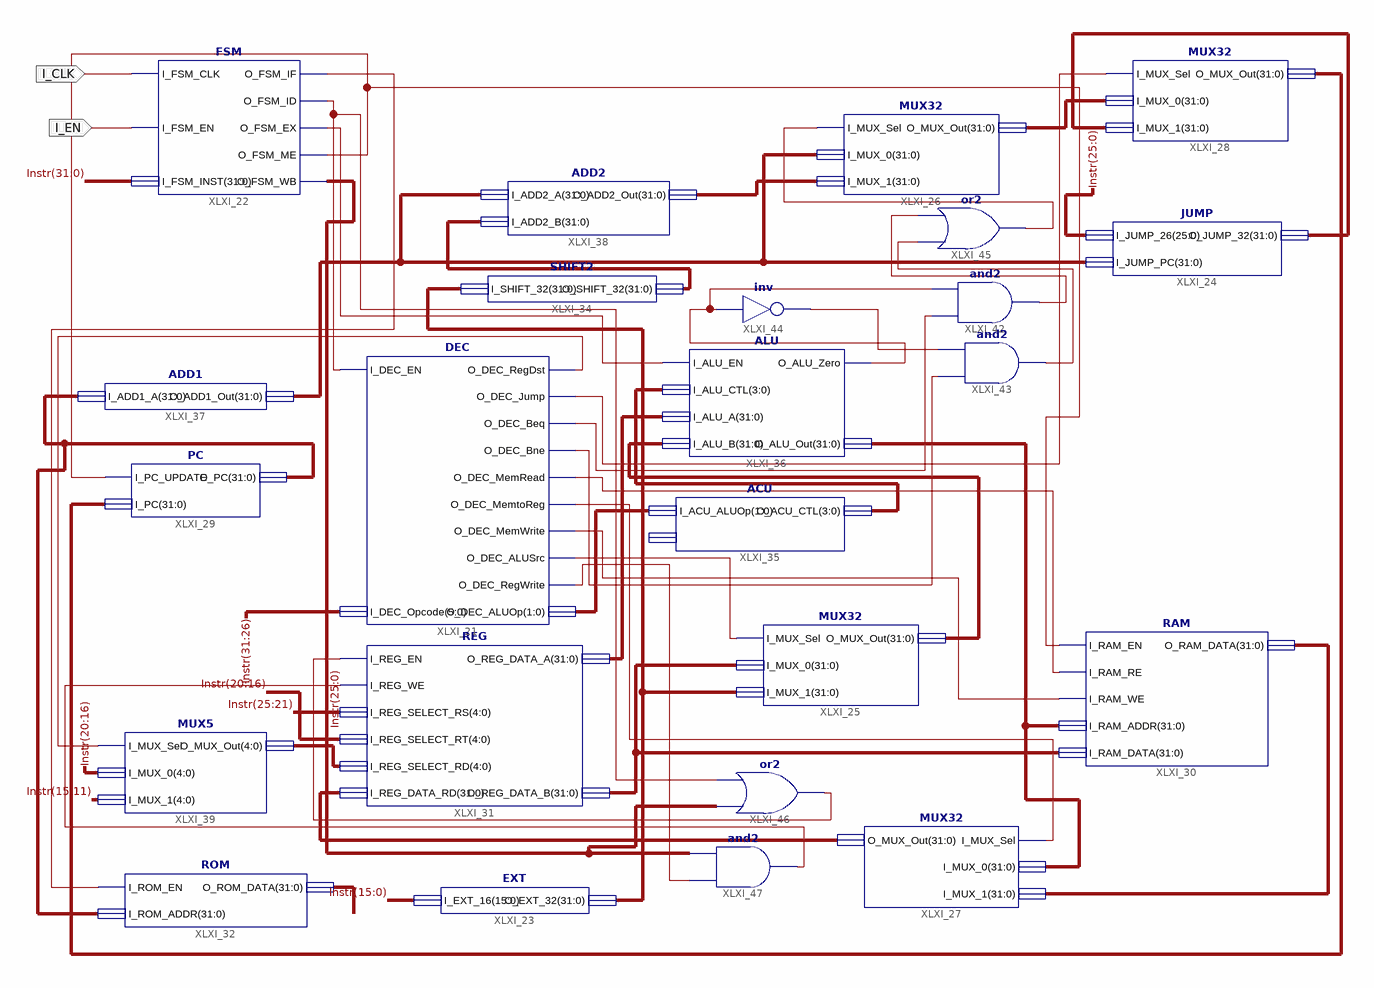
[diagram p0: schematic sheet 1]
// Xilinx ISE schematic CCSiMP32.sch (artix7) as structural Verilog: 24 symbols, 2 ports
module CCSiMP32 (
  input  I_CLK,
  input  I_EN
);

  wire XLXN_36, XLXN_37, XLXN_40, XLXN_41, XLXN_42, XLXN_43, XLXN_44, XLXN_45, XLXN_46, XLXN_47, XLXN_48,
       XLXN_49, XLXN_63, XLXN_67, XLXN_75, XLXN_77, XLXN_83, XLXN_84, XLXN_85, XLXN_87;
  wire [1:0] XLXN_65;
  wire [3:0] XLXN_28;
  wire [4:0] XLXN_12;
  wire [31:0] Instr, XLXN_13, XLXN_18, XLXN_21, XLXN_22, XLXN_24, XLXN_27, XLXN_29, XLXN_31, XLXN_32,
       XLXN_33, XLXN_34, XLXN_38, XLXN_39;

  DEC XLXI_21 (
    .I_DEC_EN(XLXN_67), .I_DEC_Opcode(Instr[31:26]), .O_DEC_RegDst(XLXN_36), .O_DEC_Jump(XLXN_37),
    .O_DEC_Beq(XLXN_40), .O_DEC_Bne(XLXN_41), .O_DEC_MemRead(XLXN_46), .O_DEC_MemtoReg(XLXN_47),
    .O_DEC_MemWrite(XLXN_48), .O_DEC_ALUSrc(XLXN_49), .O_DEC_RegWrite(XLXN_63), .O_DEC_ALUOp(XLXN_65));
  FSM XLXI_22 (
    .I_FSM_CLK(I_CLK), .I_FSM_EN(I_EN), .I_FSM_INST(Instr), .O_FSM_IF(XLXN_84), .O_FSM_ID(XLXN_67),
    .O_FSM_EX(XLXN_75), .O_FSM_ME(XLXN_85), .O_FSM_WB(Instr[25:0]));
  EXT XLXI_23 (.I_EXT_16(Instr[15:0]), .O_EXT_32(XLXN_21));
  JUMP XLXI_24 (.I_JUMP_26(Instr[25:0]), .I_JUMP_PC(XLXN_18), .O_JUMP_32(XLXN_38));
  MUX32 XLXI_26 (.I_MUX_Sel(XLXN_45), .I_MUX_0(XLXN_18), .I_MUX_1(XLXN_24), .O_MUX_Out(XLXN_39));
  MUX32 XLXI_27 (.I_MUX_Sel(XLXN_47), .I_MUX_0(XLXN_34), .I_MUX_1(XLXN_33), .O_MUX_Out(XLXN_32));
  MUX32 XLXI_28 (.I_MUX_Sel(XLXN_37), .I_MUX_0(XLXN_39), .I_MUX_1(XLXN_38), .O_MUX_Out(Instr[25:0]));
  PC XLXI_29 (.I_PC_UPDATE(XLXN_85), .I_PC(Instr[25:0]), .O_PC(XLXN_13));
  RAM XLXI_30 (
    .I_RAM_EN(XLXN_85), .I_RAM_RE(XLXN_46), .I_RAM_WE(XLXN_48), .I_RAM_ADDR(XLXN_34), .I_RAM_DATA(XLXN_31),
    .O_RAM_DATA(XLXN_33));
  REG XLXI_31 (
    .I_REG_EN(XLXN_77), .I_REG_WE(XLXN_83), .I_REG_SELECT_RS(Instr[25:21]), .I_REG_SELECT_RT(Instr[20:16]),
    .I_REG_SELECT_RD(XLXN_12), .I_REG_DATA_RD(XLXN_32), .O_REG_DATA_A(XLXN_29), .O_REG_DATA_B(XLXN_31));
  ROM XLXI_32 (.I_ROM_EN(XLXN_84), .I_ROM_ADDR(XLXN_13), .O_ROM_DATA(Instr));
  SHIFT2 XLXI_34 (.I_SHIFT_32(XLXN_21), .O_SHIFT_32(XLXN_22));
  ALU XLXI_36 (
    .I_ALU_EN(XLXN_75), .I_ALU_CTL(XLXN_28), .I_ALU_A(XLXN_29), .I_ALU_B(XLXN_27), .O_ALU_Zero(XLXN_87),
    .O_ALU_Out(XLXN_34));
  ADD1 XLXI_37 (.I_ADD1_A(XLXN_13), .O_ADD1_Out(XLXN_18));
  ADD2 XLXI_38 (.I_ADD2_A(XLXN_18), .I_ADD2_B(XLXN_22), .O_ADD2_Out(XLXN_24));
  MUX5 XLXI_39 (.I_MUX_Sel(XLXN_36), .I_MUX_0(Instr[20:16]), .I_MUX_1(Instr[15:11]), .O_MUX_Out(XLXN_12));
  MUX32 XLXI_25 (.I_MUX_Sel(XLXN_49), .I_MUX_0(XLXN_31), .I_MUX_1(XLXN_21), .O_MUX_Out(XLXN_27));
  ACU XLXI_35 (.I_ACU_ALUOp(XLXN_65), .O_ACU_CTL(XLXN_28));  // open: I_ACU_Funct
  and XLXI_42 (XLXN_43, XLXN_40, XLXN_87);
  and XLXI_43 (XLXN_44, XLXN_41, XLXN_42);
  not XLXI_44 (XLXN_42, XLXN_87);
  or XLXI_45 (XLXN_45, XLXN_44, XLXN_43);
  assign XLXN_77 = Instr[25:0] | {26{XLXN_67}};  // or2 XLXI_46, 26 bits wide
  assign XLXN_83 = {26{XLXN_63}} & Instr[25:0];  // and2 XLXI_47, 26 bits wide
endmodule
